# EAGLE schematic high-ripple-vcf-en90-11-ca3080 (EAGLE 6.6.0)
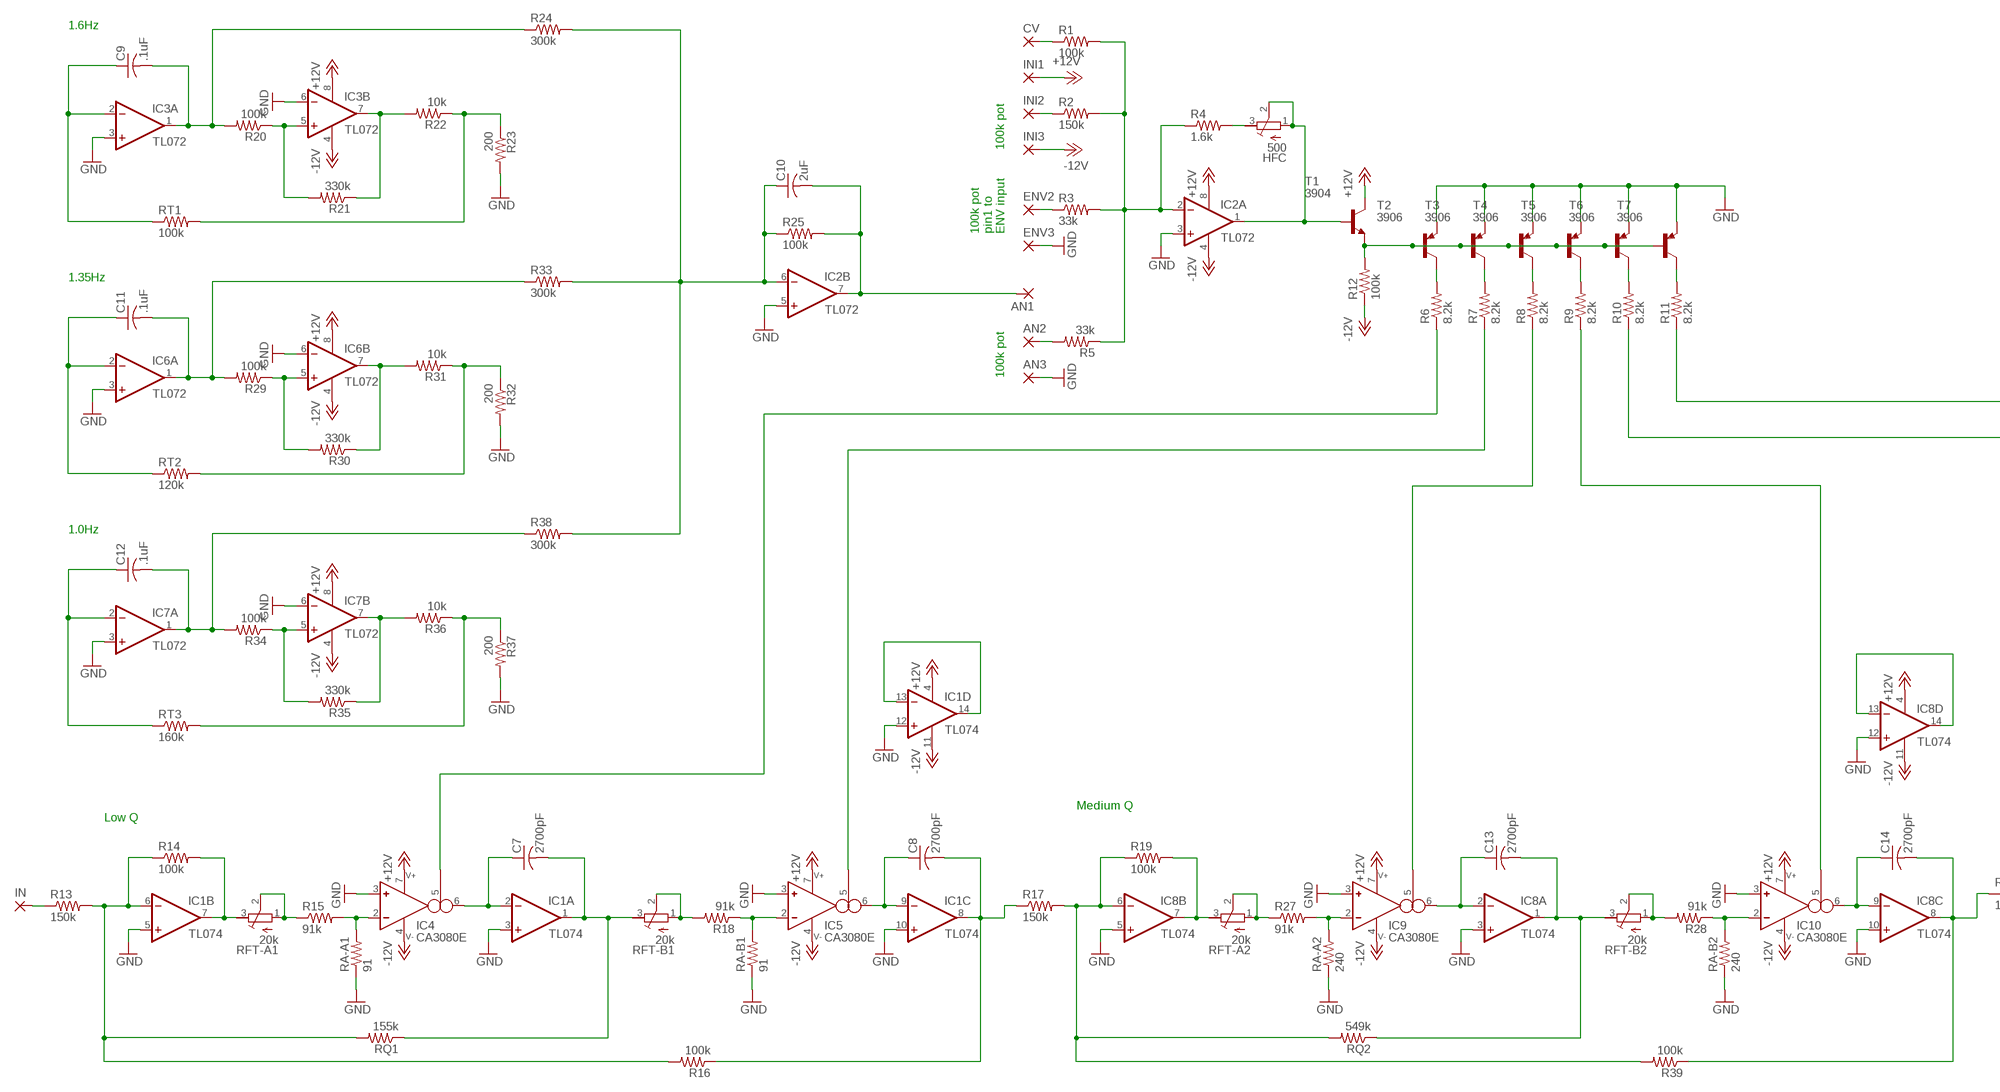
[diagram p0: schematic, sheet 1, part 1 of 2]
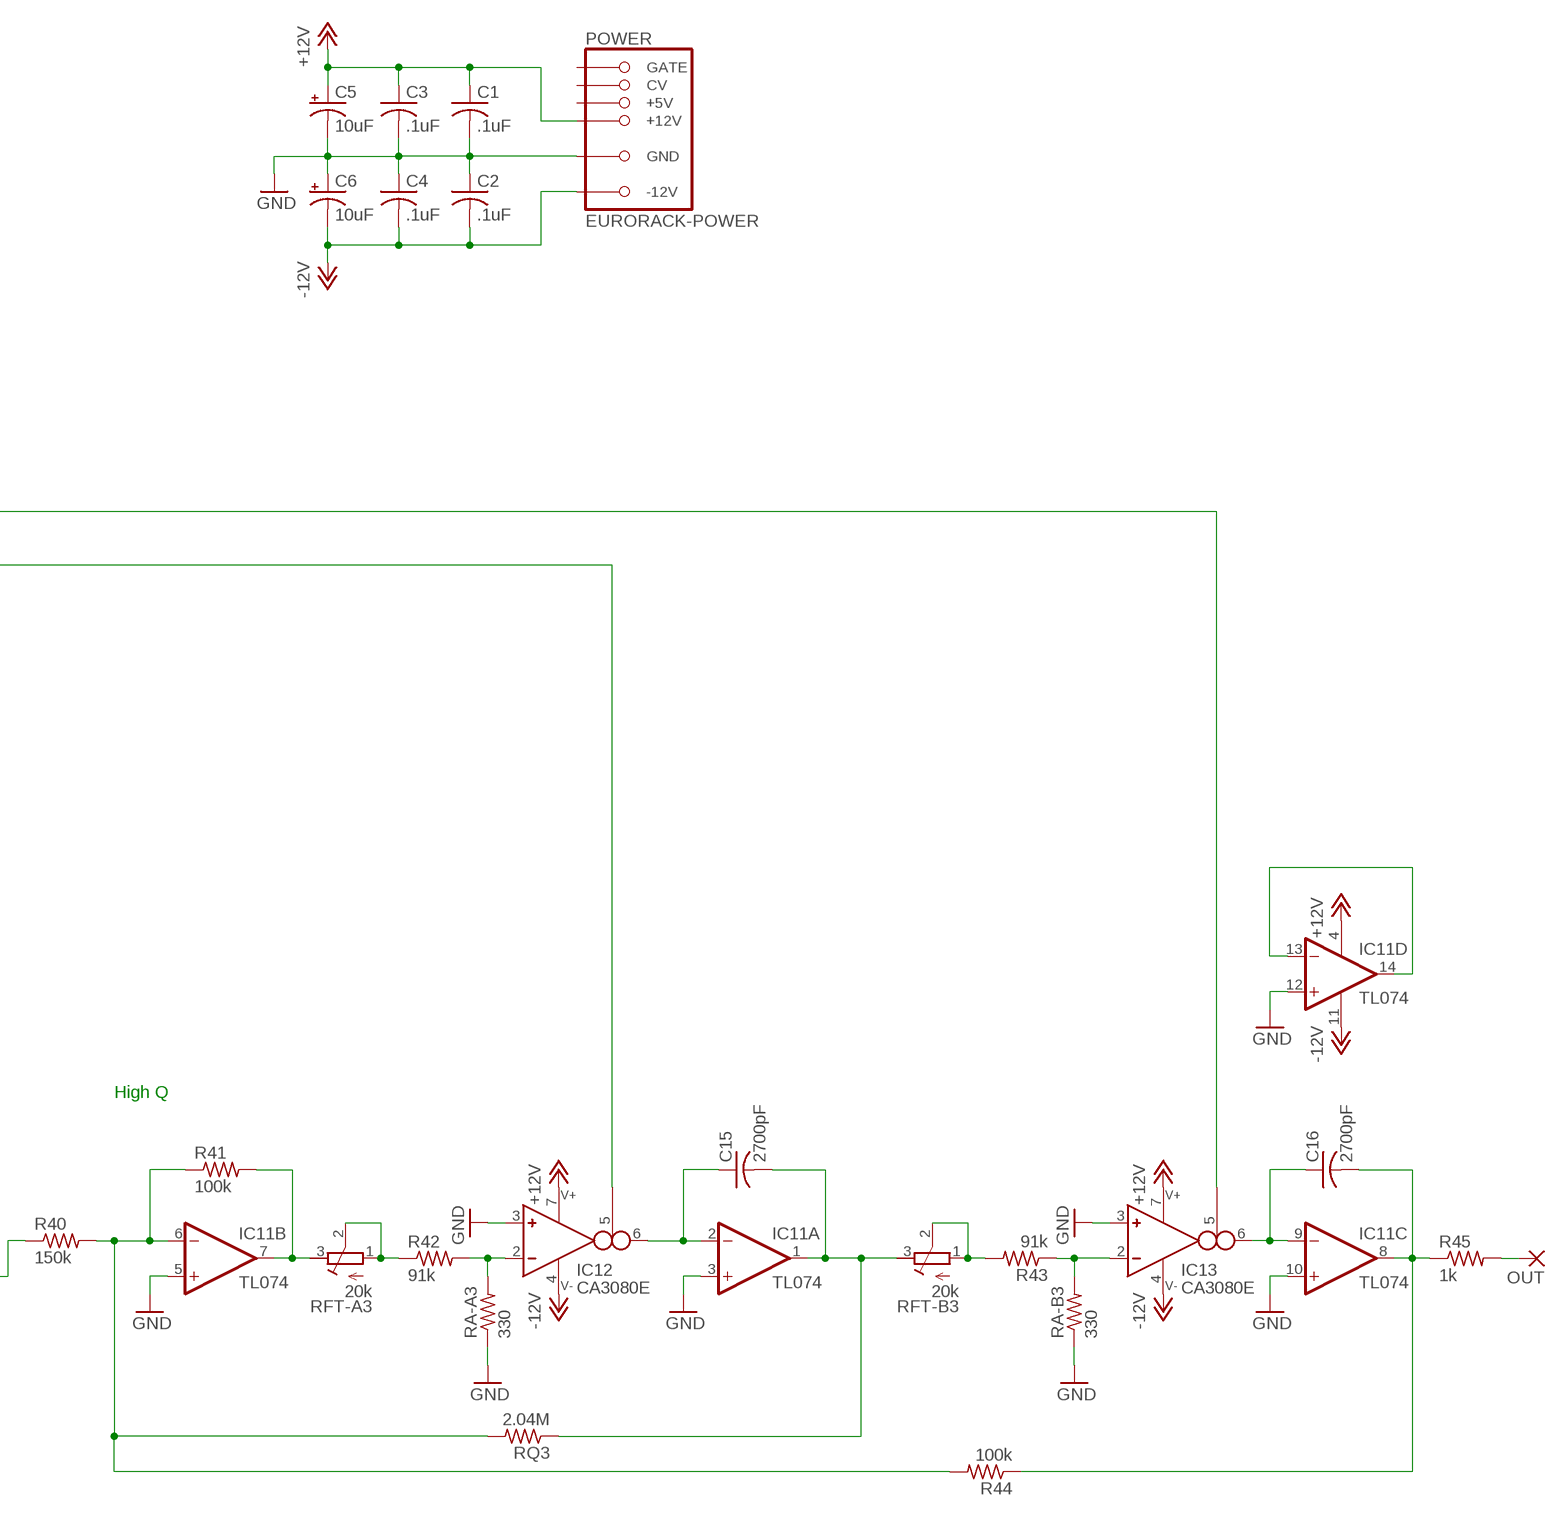
[diagram p1: schematic, sheet 1, part 2 of 2]

## Parts
AN1  2,54/1,0  [2,54/1,0]
AN2  2,54/1,0  [2,54/1,0]
AN3  2,54/1,0  [2,54/1,0]
C1  .1uF  C-US050-025X075  [C050-025X075]
C2  .1uF  C-US050-025X075  [C050-025X075]
C3  .1uF  C-US050-025X075  [C050-025X075]
C4  .1uF  C-US050-025X075  [C050-025X075]
C5  10uF  CPOL-USE2.5-5  [E2,5-5]
C6  10uF  CPOL-USE2.5-5  [E2,5-5]
C7  2700pF  C-US050-025X075  [C050-025X075]
C8  2700pF  C-US050-025X075  [C050-025X075]
C9  .1uF  C-US050-025X075  [C050-025X075]
C10  2uF  C-US050-025X075  [C050-025X075]
C11  .1uF  C-US050-025X075  [C050-025X075]
C12  .1uF  C-US050-025X075  [C050-025X075]
C13  2700pF  C-US050-025X075  [C050-025X075]
C14  2700pF  C-US050-025X075  [C050-025X075]
C15  2700pF  C-US050-025X075  [C050-025X075]
C16  2700pF  C-US050-025X075  [C050-025X075]
CV  2,54/1,0  [2,54/1,0]
ENV2  2,54/1,0  [2,54/1,0]
ENV3  2,54/1,0  [2,54/1,0]
HFC  500  R-TRIMM64W  [RTRIM64W]
IC1  TL074  TL074-TOPP  [DIL14]
IC2  TL072  TL072-TOPP  [DIL08]
IC3  TL072  TL072-TOPP  [DIL08]
IC4  CA3080E  [DIL08]
IC5  CA3080E  [DIL08]
IC6  TL072  TL072-TOPP  [DIL08]
IC7  TL072  TL072-TOPP  [DIL08]
IC8  TL074  TL074-TOPP  [DIL14]
IC9  CA3080E  [DIL08]
IC10  CA3080E  [DIL08]
IC11  TL074  TL074-TOPP  [DIL14]
IC12  CA3080E  [DIL08]
IC13  CA3080E  [DIL08]
IN  2,54/1,0  [2,54/1,0]
INI1  2,54/1,0  [2,54/1,0]
INI2  2,54/1,0  [2,54/1,0]
INI3  2,54/1,0  [2,54/1,0]
OUT  2,54/1,0  [2,54/1,0]
POWER  EURORACK-POWER  [PINSHRD_PTH_2X8]
R1  100k  R-US_0207/10  [0207/10]
R2  150k  R-US_0207/10  [0207/10]
R3  33k  R-US_0207/10  [0207/10]
R4  1.6k  R-US_0207/10  [0207/10]
R5  33k  R-US_0207/10  [0207/10]
R6  8.2k  R-US_0207/10  [0207/10]
R7  8.2k  R-US_0207/10  [0207/10]
R8  8.2k  R-US_0207/10  [0207/10]
R9  8.2k  R-US_0207/10  [0207/10]
R10  8.2k  R-US_0207/10  [0207/10]
R11  8.2k  R-US_0207/10  [0207/10]
R12  100k  R-US_0207/10  [0207/10]
R13  150k  R-US_0207/10  [0207/10]
R14  100k  R-US_0207/10  [0207/10]
R15  91k  R-US_0207/10  [0207/10]
R16  100k  R-US_0207/10  [0207/10]
R17  150k  R-US_0207/10  [0207/10]
R18  91k  R-US_0207/10  [0207/10]
R19  100k  R-US_0207/10  [0207/10]
R20  100k  R-US_0207/10  [0207/10]
R21  330k  R-US_0207/10  [0207/10]
R22  10k  R-US_0207/10  [0207/10]
R23  200  R-US_0207/10  [0207/10]
R24  300k  R-US_0207/10  [0207/10]
R25  100k  R-US_0207/10  [0207/10]
R27  91k  R-US_0207/10  [0207/10]
R28  91k  R-US_0207/10  [0207/10]
R29  100k  R-US_0207/10  [0207/10]
R30  330k  R-US_0207/10  [0207/10]
R31  10k  R-US_0207/10  [0207/10]
R32  200  R-US_0207/10  [0207/10]
R33  300k  R-US_0207/10  [0207/10]
R34  100k  R-US_0207/10  [0207/10]
R35  330k  R-US_0207/10  [0207/10]
R36  10k  R-US_0207/10  [0207/10]
R37  200  R-US_0207/10  [0207/10]
R38  300k  R-US_0207/10  [0207/10]
R39  100k  R-US_0207/10  [0207/10]
R40  150k  R-US_0207/10  [0207/10]
R41  100k  R-US_0207/10  [0207/10]
R42  91k  R-US_0207/10  [0207/10]
R43  91k  R-US_0207/10  [0207/10]
R44  100k  R-US_0207/10  [0207/10]
R45  1k  R-US_0207/10  [0207/10]
RA-A1  91  R-US_0207/10  [0207/10]
RA-A2  240  R-US_0207/10  [0207/10]
RA-A3  330  R-US_0207/10  [0207/10]
RA-B1  91  R-US_0207/10  [0207/10]
RA-B2  240  R-US_0207/10  [0207/10]
RA-B3  330  R-US_0207/10  [0207/10]
RFT-A1  20k  R-TRIMM64W  [RTRIM64W]
RFT-A2  20k  R-TRIMM64W  [RTRIM64W]
RFT-A3  20k  R-TRIMM64W  [RTRIM64W]
RFT-B1  20k  R-TRIMM64W  [RTRIM64W]
RFT-B2  20k  R-TRIMM64W  [RTRIM64W]
RFT-B3  20k  R-TRIMM64W  [RTRIM64W]
RQ1  155k  R-US_0207/10  [0207/10]
RQ2  549k  R-US_0207/10  [0207/10]
RQ3  2.04M  R-US_0207/10  [0207/10]
RT1  100k  R-US_0207/10  [0207/10]
RT2  120k  R-US_0207/10  [0207/10]
RT3  160k  R-US_0207/10  [0207/10]
T1  3904  2N3904-NPN-TO92-EBC  [TO92-EBC]
T2  3906  2N3906-PNP-TO92-EBC  [TO92-EBC]
T3  3906  2N3906-PNP-TO92-EBC  [TO92-EBC]
T4  3906  2N3906-PNP-TO92-EBC  [TO92-EBC]
T5  3906  2N3906-PNP-TO92-EBC  [TO92-EBC]
T6  3906  2N3906-PNP-TO92-EBC  [TO92-EBC]
T7  3906  2N3906-PNP-TO92-EBC  [TO92-EBC]

## Nets
+12V: C1.1 C3.1 C5.+ IC1.4(P:V+) IC2.8(P:V+) IC3.8(P:V+) IC4.7 IC5.7 IC6.8(P:V+) IC7.8(P:V+) IC8.4(P:V+) IC9.7 IC10.7 IC11.4(P:V+) IC12.7 IC13.7 INI1.1(P) POWER.+12V@1(+12V) POWER.+12V@2(+12V) T1.C
-12V: C2.2 C4.2 C6.- IC1.11(P:V-) IC2.4(P:V-) IC3.4(P:V-) IC4.4 IC5.4 IC6.4(P:V-) IC7.4(P:V-) IC8.11(P:V-) IC9.4 IC10.4 IC11.11(P:V-) IC12.4 IC13.4 INI3.1(P) POWER.-12V@1(-12V) POWER.-12V@2(-12V) R12.1
A: IC4.5(I_BIAS) R6.1
B: IC5.5(I_BIAS) R7.1
C: IC9.5(I_BIAS) R8.1
D: IC10.5(I_BIAS) R9.1
E: IC12.5(I_BIAS) R10.1
GND: AN3.1(P) C1.2 C2.1 C3.2 C4.1 C5.- C6.+ ENV3.1(P) IC1.3(A:+IN) IC1.5(B:+IN) IC1.10(C:+IN) IC1.12(D:+IN) IC2.3(A:+IN) IC2.5(B:+IN) IC3.3(A:+IN) IC3.6(B:-IN) IC4.3(IN_P) IC5.3(IN_P) IC6.3(A:+IN) IC6.6(B:-IN) IC7.3(A:+IN) IC7.6(B:-IN) IC8.3(A:+IN) IC8.5(B:+IN) IC8.10(C:+IN) IC8.12(D:+IN) IC9.3(IN_P) IC10.3(IN_P) IC11.3(A:+IN) IC11.5(B:+IN) IC11.10(C:+IN) IC11.12(D:+IN) IC12.3(IN_P) IC13.3(IN_P) POWER.GND@1(GND) POWER.GND@2(GND) POWER.GND@3(GND) POWER.GND@4(GND) POWER.GND@5(GND) POWER.GND@6(GND) R23.2 R32.2 R37.2 RA-A1.1 RA-A2.1 RA-A3.1 RA-B1.1 RA-B2.1 RA-B3.1 T2.E T3.E T4.E T5.E T6.E T7.E
N$1: C10.1 IC2.6(B:-IN) R24.2 R25.1 R33.2 R38.2
N$2: CV.1(P) R1.1
N$3: INI2.1(P) R2.1
N$4: ENV2.1(P) R3.1
N$5: AN2.1(P) R5.2
N$6: IC2.2(A:-IN) R1.2 R2.2 R3.2 R4.1 R5.1
N$7: HFC.3(E) R4.2
N$8: HFC.1(A) HFC.2(S) IC2.1(A:OUT) T1.B
N$9: R12.2 T1.E T2.B T3.B T4.B T5.B T6.B T7.B
N$10: R6.2 T2.C
N$11: R7.2 T3.C
N$12: R8.2 T4.C
N$13: R9.2 T5.C
N$14: R10.2 T6.C
N$15: R11.2 T7.C
N$16: C9.2 IC3.1(A:OUT) R20.2 R24.1
N$17: IC3.5(B:+IN) R20.1 R21.2
N$18: IC3.7(B:OUT) R21.1 R22.2
N$19: R22.1 R23.1 RT1.2
N$20: C11.2 IC6.1(A:OUT) R29.2 R33.1
N$21: C9.1 IC3.2(A:-IN) RT1.1
N$22: IC6.5(B:+IN) R29.1 R30.2
N$23: IC6.7(B:OUT) R30.1 R31.2
N$24: R31.1 R32.1 RT2.2
N$25: C11.1 IC6.2(A:-IN) RT2.1
N$26: C12.2 IC7.1(A:OUT) R34.2 R38.1
N$27: IC7.5(B:+IN) R34.1 R35.2
N$28: IC7.7(B:OUT) R35.1 R36.2
N$29: R36.1 R37.1 RT3.2
N$30: C12.1 IC7.2(A:-IN) RT3.1
N$31: C8.2 IC1.8(C:OUT) R16.1 R17.1
N$32: IC8.7(B:OUT) R19.2 RFT-A2.3(E)
N$33: R27.1 RFT-A2.1(A) RFT-A2.2(S)
N$34: IC9.2(IN_N) R27.2 RA-A2.2
N$35: C13.1 IC8.2(A:-IN) IC9.6(OUT)
N$36: IC1.7(B:OUT) R14.2 RFT-A1.3(E)
N$37: R15.1 RFT-A1.1(A) RFT-A1.2(S)
N$38: IC4.2(IN_N) R15.2 RA-A1.2
N$39: C7.1 IC1.2(A:-IN) IC4.6(OUT)
N$40: C7.2 IC1.1(A:OUT) RFT-B1.3(E) RQ1.1
N$41: C13.2 IC8.1(A:OUT) RFT-B2.3(E) RQ2.1
N$42: R18.2 RFT-B1.1(A) RFT-B1.2(S)
N$43: IC5.2(IN_N) R18.1 RA-B1.2
N$44: C8.1 IC1.9(C:-IN) IC5.6(OUT)
N$45: IC1.6(B:-IN) R13.2 R14.1 R16.2 RQ1.2
N$46: IC1.13(D:-IN) IC1.14(D:OUT)
N$47: R28.2 RFT-B2.1(A) RFT-B2.2(S)
N$48: IC10.2(IN_N) R28.1 RA-B2.2
N$49: C14.1 IC8.9(C:-IN) IC10.6(OUT)
N$50: IC8.6(B:-IN) R17.2 R19.1 R39.2 RQ2.2
N$51: IC8.13(D:-IN) IC8.14(D:OUT)
N$52: C14.2 IC8.8(C:OUT) R39.1 R40.1
N$53: IC11.7(B:OUT) R41.2 RFT-A3.3(E)
N$54: R42.1 RFT-A3.1(A) RFT-A3.2(S)
N$55: IC12.2(IN_N) R42.2 RA-A3.2
N$56: C15.1 IC11.2(A:-IN) IC12.6(OUT)
N$57: C15.2 IC11.1(A:OUT) RFT-B3.3(E) RQ3.1
N$58: R43.2 RFT-B3.1(A) RFT-B3.2(S)
N$59: IC13.2(IN_N) R43.1 RA-B3.2
N$60: C16.1 IC11.9(C:-IN) IC13.6(OUT)
N$61: IC11.6(B:-IN) R40.2 R41.1 R44.2 RQ3.2
N$62: IC11.13(D:-IN) IC11.14(D:OUT)
N$63: C16.2 IC11.8(C:OUT) R44.1 R45.1
N$64: IN.1(P) R13.1
N$65: OUT.1(P) R45.2
N$66: IC13.5(I_BIAS) R11.1
X: AN1.1(P) C10.2 IC2.7(B:OUT) R25.2
Unconnected: POWER.+5V@1(+5V) POWER.+5V@2(+5V) POWER.CV@1(CV) POWER.CV@2(CV) POWER.GATE@1(GATE) POWER.GATE@2(GATE)

## Notes on the sheet
- 1.6Hz
- 100k pot
- 100k pot
  pin1 to
  ENV input
- 1.35Hz
- 100k pot
- 1.0Hz
- High Q
- Medium Q
- Low Q

## Library data of the parts
AN1-AN3 CV ENV2 ENV3 IN INI1-INI3 OUT = wirepad:2,54/1,0: THROUGH-HOLE PAD
C1-C4 C7-C16 = rcl:C-US: CAPACITOR, American symbol
C5 C6 = rcl:CPOL-US: POLARIZED CAPACITOR, American symbol
HFC RFT-A1-RFT-A3 RFT-B1-RFT-B3 = rcl:R-TRIMM: Trimm resistor
IC1 IC8 IC11 = mmoretti:TL074-TOP: OP AMP
IC2 IC3 IC6 IC7 = mmoretti:TL072-TOP: OP AMP
IC4 IC5 IC9 IC10 IC12 IC13 = mmoretti:CA3080: OTA
POWER = mmoretti:EURORACK-POWER
R1-R25 R27-R45 RA-A1-RA-A3 RA-B1-RA-B3 RQ1-RQ3 RT1-RT3 = rcl:R-US_: RESISTOR, American symbol
T1 = transistor-neu-to92:*-NPN-: NPN Transistror
T2-T7 = transistor-neu-to92:*-PNP-: PNP Transistror